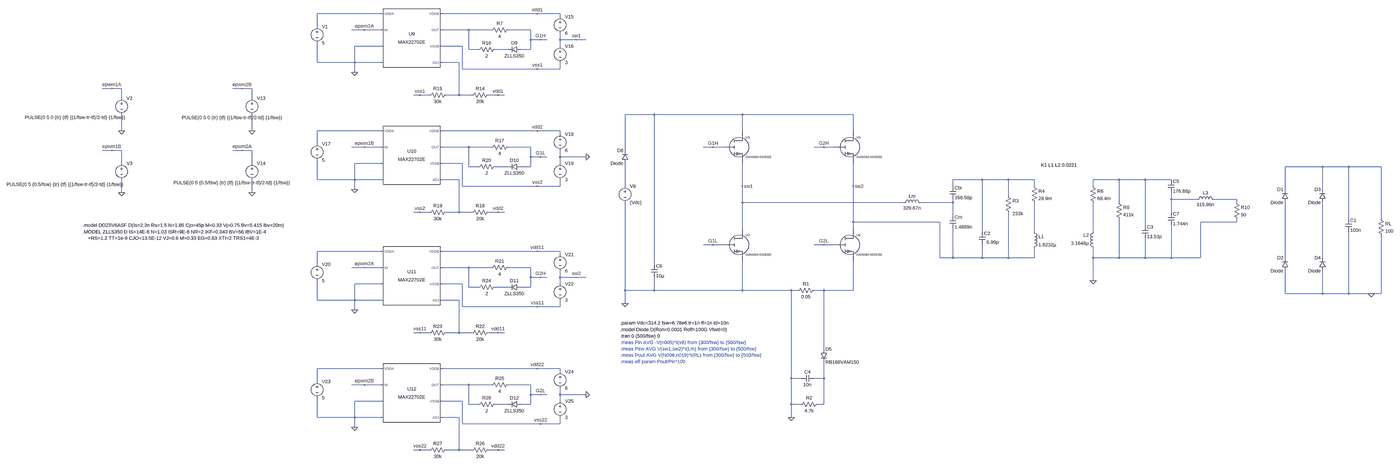
[diagram p0: schematic 1kW_LCCLS_sim.asc, whole sheet]
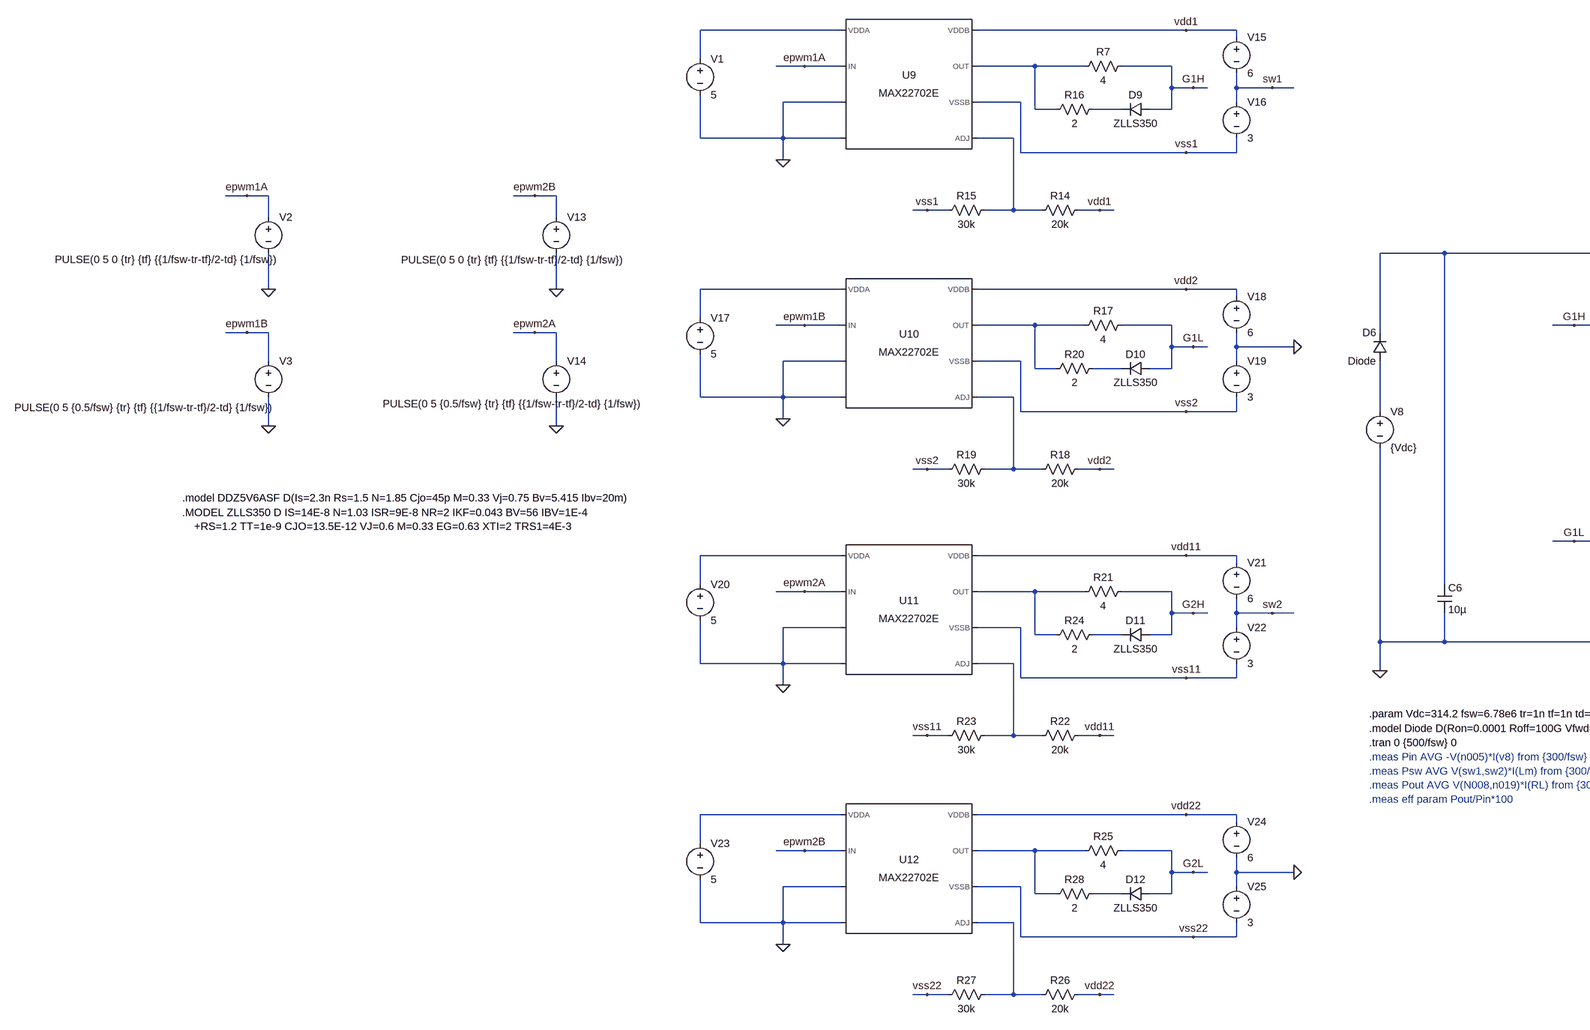
[diagram p1: schematic 1kW_LCCLS_sim.asc, part, row 1 of 1, column 1 of 2]
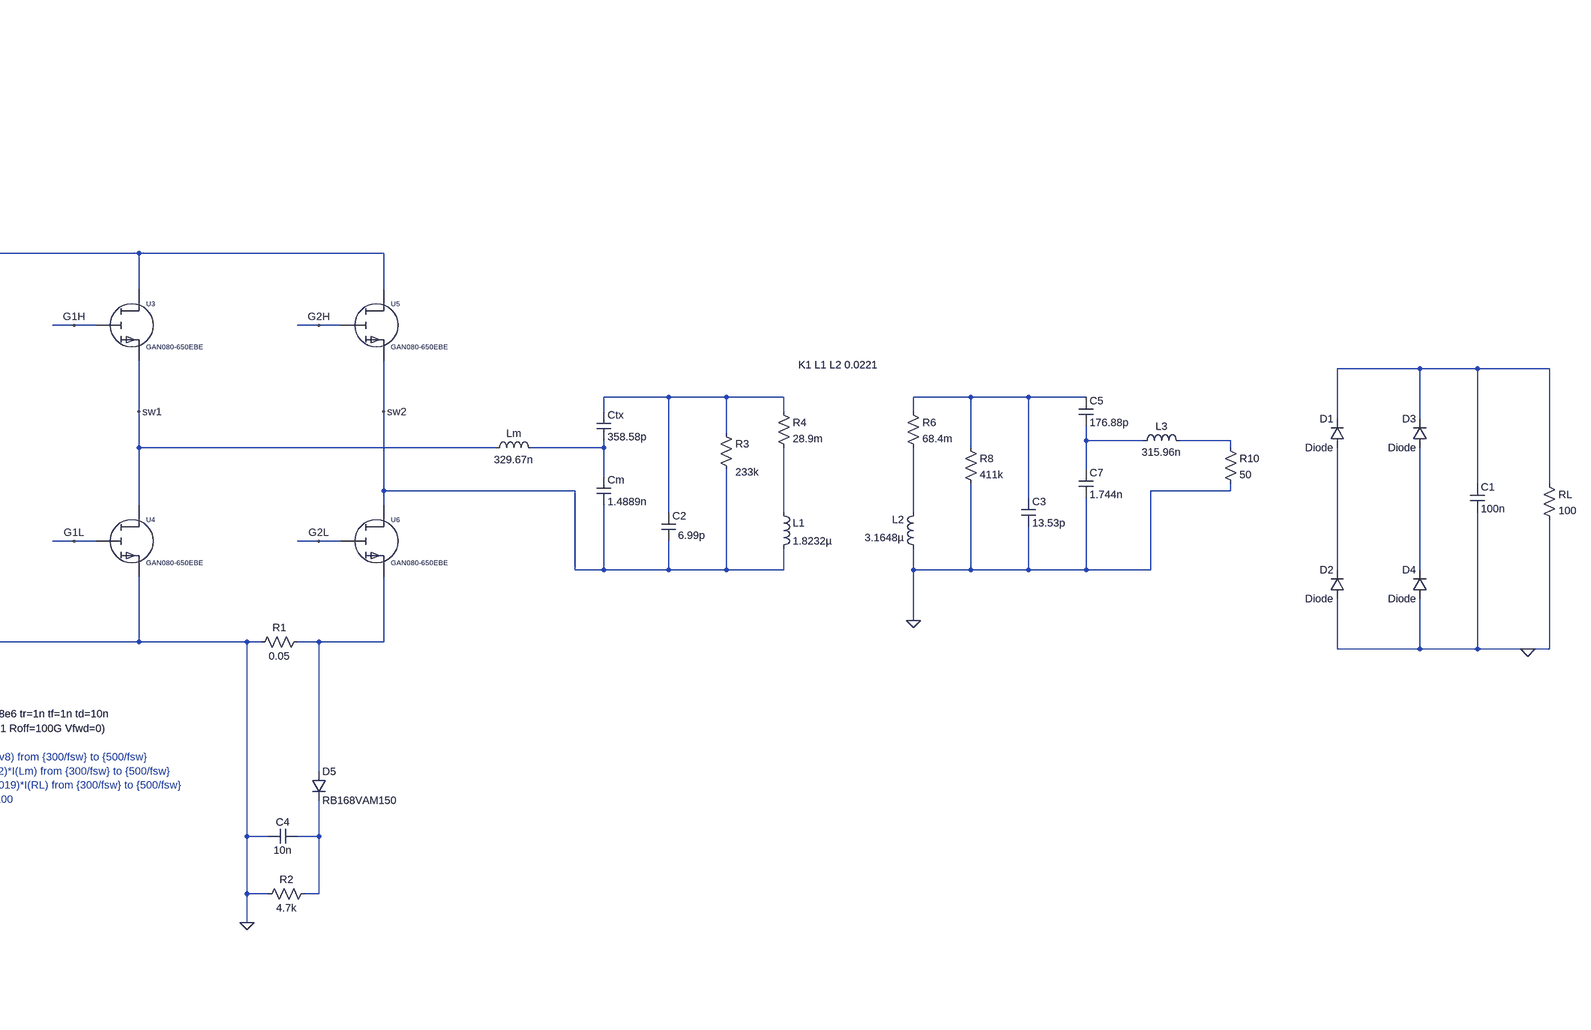
[diagram p2: schematic 1kW_LCCLS_sim.asc, part, row 1 of 1, column 2 of 2]
1kW_LCCLS_sim.asc, the LTspice schematic file:
Version 4.1
SHEET 1 3412 680
WIRE -2160 -4192 -2496 -4192
WIRE -1392 -4192 -1856 -4192
WIRE -1280 -4192 -1392 -4192
WIRE -1280 -4176 -1280 -4192
WIRE -2496 -4128 -2496 -4192
WIRE -2240 -4112 -2304 -4112
WIRE -2160 -4112 -2240 -4112
WIRE -1728 -4112 -1856 -4112
WIRE -1616 -4112 -1728 -4112
WIRE -1424 -4112 -1536 -4112
WIRE -1424 -4064 -1424 -4112
WIRE -1376 -4064 -1424 -4064
WIRE -1344 -4064 -1376 -4064
WIRE -1280 -4064 -1280 -4096
WIRE -1200 -4064 -1280 -4064
WIRE -1152 -4064 -1200 -4064
WIRE -2160 -4032 -2288 -4032
WIRE -1760 -4032 -1856 -4032
WIRE -1280 -4032 -1280 -4064
WIRE -1728 -4016 -1728 -4112
WIRE -1680 -4016 -1728 -4016
WIRE -1536 -4016 -1600 -4016
WIRE -1424 -4016 -1424 -4064
WIRE -1424 -4016 -1472 -4016
WIRE -2496 -3952 -2496 -4048
WIRE -2288 -3952 -2288 -4032
WIRE -2288 -3952 -2496 -3952
WIRE -2160 -3952 -2288 -3952
WIRE -1776 -3952 -1856 -3952
WIRE -1760 -3920 -1760 -4032
WIRE -1392 -3920 -1760 -3920
WIRE -1280 -3920 -1280 -3952
WIRE -1280 -3920 -1392 -3920
WIRE -2288 -3904 -2288 -3952
WIRE -3872 -3824 -3920 -3824
WIRE -3824 -3824 -3872 -3824
WIRE -3232 -3824 -3280 -3824
WIRE -3184 -3824 -3232 -3824
WIRE -1968 -3792 -2000 -3792
WIRE -1920 -3792 -1968 -3792
WIRE -1776 -3792 -1776 -3952
WIRE -1776 -3792 -1840 -3792
WIRE -1712 -3792 -1776 -3792
WIRE -1584 -3792 -1632 -3792
WIRE -1552 -3792 -1584 -3792
WIRE -3824 -3776 -3824 -3824
WIRE -3184 -3776 -3184 -3824
WIRE -592 -3696 -736 -3696
WIRE -160 -3696 -592 -3696
WIRE 384 -3696 -160 -3696
WIRE -3824 -3616 -3824 -3696
WIRE -3184 -3616 -3184 -3696
WIRE -2160 -3616 -2496 -3616
WIRE -1392 -3616 -1856 -3616
WIRE -1280 -3616 -1392 -3616
WIRE -160 -3616 -160 -3696
WIRE 384 -3616 384 -3696
WIRE -1280 -3600 -1280 -3616
WIRE -2496 -3552 -2496 -3616
WIRE -2240 -3536 -2304 -3536
WIRE -2160 -3536 -2240 -3536
WIRE -1728 -3536 -1856 -3536
WIRE -1616 -3536 -1728 -3536
WIRE -1424 -3536 -1536 -3536
WIRE -304 -3536 -352 -3536
WIRE -256 -3536 -304 -3536
WIRE 240 -3536 192 -3536
WIRE 288 -3536 240 -3536
WIRE -3872 -3520 -3920 -3520
WIRE -3824 -3520 -3872 -3520
WIRE -3232 -3520 -3280 -3520
WIRE -3184 -3520 -3232 -3520
WIRE -736 -3520 -736 -3696
WIRE -1424 -3488 -1424 -3536
WIRE -1376 -3488 -1424 -3488
WIRE -1344 -3488 -1376 -3488
WIRE -1280 -3488 -1280 -3520
WIRE -1152 -3488 -1280 -3488
WIRE -3824 -3456 -3824 -3520
WIRE -3184 -3456 -3184 -3520
WIRE -2160 -3456 -2288 -3456
WIRE -1760 -3456 -1856 -3456
WIRE -1280 -3456 -1280 -3488
WIRE -1728 -3440 -1728 -3536
WIRE -1680 -3440 -1728 -3440
WIRE -1536 -3440 -1600 -3440
WIRE -1424 -3440 -1424 -3488
WIRE -1424 -3440 -1472 -3440
WIRE 3056 -3440 2864 -3440
WIRE 3184 -3440 3056 -3440
WIRE 3344 -3440 3184 -3440
WIRE -2496 -3376 -2496 -3472
WIRE -2288 -3376 -2288 -3456
WIRE -2288 -3376 -2496 -3376
WIRE -2160 -3376 -2288 -3376
WIRE -1776 -3376 -1856 -3376
WIRE 1136 -3376 992 -3376
WIRE 1264 -3376 1136 -3376
WIRE 1392 -3376 1264 -3376
WIRE 1808 -3376 1680 -3376
WIRE 1936 -3376 1808 -3376
WIRE 2064 -3376 1936 -3376
WIRE -1760 -3344 -1760 -3456
WIRE -1392 -3344 -1760 -3344
WIRE -1280 -3344 -1280 -3376
WIRE -1280 -3344 -1392 -3344
WIRE -736 -3344 -736 -3456
WIRE -160 -3344 -160 -3456
WIRE 384 -3344 384 -3456
WIRE 992 -3344 992 -3376
WIRE 1392 -3344 1392 -3376
WIRE 1680 -3344 1680 -3376
WIRE -2288 -3328 -2288 -3376
WIRE 2864 -3328 2864 -3440
WIRE 3056 -3328 3056 -3440
WIRE -3824 -3312 -3824 -3376
WIRE -3184 -3312 -3184 -3376
WIRE 1264 -3296 1264 -3376
WIRE 2064 -3280 2064 -3312
WIRE 2192 -3280 2064 -3280
WIRE 2432 -3280 2272 -3280
WIRE -160 -3264 -160 -3344
WIRE 752 -3264 -160 -3264
WIRE 992 -3264 992 -3280
WIRE 992 -3264 832 -3264
WIRE 1808 -3264 1808 -3376
WIRE 2432 -3264 2432 -3280
WIRE -1968 -3216 -2000 -3216
WIRE -1920 -3216 -1968 -3216
WIRE -1776 -3216 -1776 -3376
WIRE -1776 -3216 -1840 -3216
WIRE -1712 -3216 -1776 -3216
WIRE -1584 -3216 -1632 -3216
WIRE -1552 -3216 -1584 -3216
WIRE 2064 -3216 2064 -3280
WIRE 992 -3200 992 -3264
WIRE 3184 -3184 3184 -3440
WIRE 3344 -3184 3344 -3440
WIRE 384 -3168 384 -3344
WIRE 928 -3168 384 -3168
WIRE 2432 -3168 2432 -3184
WIRE 2432 -3168 2208 -3168
WIRE 1936 -3152 1936 -3376
WIRE -160 -3136 -160 -3264
WIRE 384 -3136 384 -3168
WIRE 1136 -3120 1136 -3376
WIRE 1392 -3120 1392 -3264
WIRE 1680 -3120 1680 -3264
WIRE -304 -3056 -352 -3056
WIRE -256 -3056 -304 -3056
WIRE 240 -3056 192 -3056
WIRE 288 -3056 240 -3056
WIRE -2160 -3024 -2496 -3024
WIRE -1392 -3024 -1856 -3024
WIRE -1280 -3024 -1392 -3024
WIRE -1280 -3008 -1280 -3024
WIRE 928 -2992 928 -3168
WIRE 992 -2992 992 -3136
WIRE 992 -2992 928 -2992
WIRE 1136 -2992 1136 -3056
WIRE 1136 -2992 992 -2992
WIRE 1264 -2992 1264 -3216
WIRE 1264 -2992 1136 -2992
WIRE 1392 -2992 1392 -3040
WIRE 1392 -2992 1264 -2992
WIRE 1680 -2992 1680 -3040
WIRE 1808 -2992 1808 -3184
WIRE 1808 -2992 1680 -2992
WIRE 1936 -2992 1936 -3088
WIRE 1936 -2992 1808 -2992
WIRE 2064 -2992 2064 -3152
WIRE 2064 -2992 1936 -2992
WIRE 2208 -2992 2208 -3168
WIRE 2208 -2992 2064 -2992
WIRE 2864 -2992 2864 -3264
WIRE 3056 -2992 3056 -3264
WIRE -2496 -2960 -2496 -3024
WIRE -592 -2960 -592 -3696
WIRE -2240 -2944 -2304 -2944
WIRE -2160 -2944 -2240 -2944
WIRE -1728 -2944 -1856 -2944
WIRE -1616 -2944 -1728 -2944
WIRE -1424 -2944 -1536 -2944
WIRE -1424 -2896 -1424 -2944
WIRE -1376 -2896 -1424 -2896
WIRE -1344 -2896 -1376 -2896
WIRE -1280 -2896 -1280 -2928
WIRE -1200 -2896 -1280 -2896
WIRE -1152 -2896 -1200 -2896
WIRE 1680 -2880 1680 -2992
WIRE -2160 -2864 -2288 -2864
WIRE -1760 -2864 -1856 -2864
WIRE -1280 -2864 -1280 -2896
WIRE -1728 -2848 -1728 -2944
WIRE -1680 -2848 -1728 -2848
WIRE -1536 -2848 -1600 -2848
WIRE -1424 -2848 -1424 -2896
WIRE -1424 -2848 -1472 -2848
WIRE -736 -2832 -736 -3264
WIRE -592 -2832 -592 -2896
WIRE -592 -2832 -736 -2832
WIRE -160 -2832 -160 -2976
WIRE -160 -2832 -592 -2832
WIRE 80 -2832 -160 -2832
WIRE 112 -2832 80 -2832
WIRE 240 -2832 192 -2832
WIRE 384 -2832 384 -2976
WIRE 384 -2832 240 -2832
WIRE 2864 -2816 2864 -2928
WIRE 3056 -2816 3056 -2928
WIRE 3056 -2816 2864 -2816
WIRE 3184 -2816 3184 -3120
WIRE 3184 -2816 3056 -2816
WIRE 3296 -2816 3184 -2816
WIRE 3344 -2816 3344 -3104
WIRE 3344 -2816 3296 -2816
WIRE -2496 -2784 -2496 -2880
WIRE -2288 -2784 -2288 -2864
WIRE -2288 -2784 -2496 -2784
WIRE -2160 -2784 -2288 -2784
WIRE -1776 -2784 -1856 -2784
WIRE -736 -2768 -736 -2832
WIRE -1760 -2752 -1760 -2864
WIRE -1392 -2752 -1760 -2752
WIRE -1280 -2752 -1280 -2784
WIRE -1280 -2752 -1392 -2752
WIRE -2288 -2736 -2288 -2784
WIRE -1968 -2624 -2000 -2624
WIRE -1920 -2624 -1968 -2624
WIRE -1776 -2624 -1776 -2784
WIRE -1776 -2624 -1840 -2624
WIRE -1712 -2624 -1776 -2624
WIRE -1584 -2624 -1632 -2624
WIRE -1552 -2624 -1584 -2624
WIRE 240 -2544 240 -2832
WIRE -2160 -2448 -2496 -2448
WIRE -1392 -2448 -1856 -2448
WIRE -1280 -2448 -1392 -2448
WIRE -1280 -2432 -1280 -2448
WIRE 80 -2400 80 -2832
WIRE 128 -2400 80 -2400
WIRE 240 -2400 240 -2480
WIRE 240 -2400 192 -2400
WIRE -2496 -2384 -2496 -2448
WIRE -2240 -2368 -2304 -2368
WIRE -2160 -2368 -2240 -2368
WIRE -1728 -2368 -1856 -2368
WIRE -1616 -2368 -1728 -2368
WIRE -1424 -2368 -1536 -2368
WIRE -1424 -2320 -1424 -2368
WIRE -1376 -2320 -1424 -2320
WIRE -1344 -2320 -1376 -2320
WIRE -1280 -2320 -1280 -2352
WIRE -1152 -2320 -1280 -2320
WIRE -2160 -2288 -2288 -2288
WIRE -1760 -2288 -1856 -2288
WIRE -1280 -2288 -1280 -2320
WIRE -1728 -2272 -1728 -2368
WIRE -1680 -2272 -1728 -2272
WIRE -1536 -2272 -1600 -2272
WIRE -1424 -2272 -1424 -2320
WIRE -1424 -2272 -1472 -2272
WIRE 80 -2272 80 -2400
WIRE 128 -2272 80 -2272
WIRE 240 -2272 240 -2400
WIRE 240 -2272 208 -2272
WIRE -2496 -2208 -2496 -2304
WIRE -2288 -2208 -2288 -2288
WIRE -2288 -2208 -2496 -2208
WIRE -2160 -2208 -2288 -2208
WIRE -1776 -2208 -1856 -2208
WIRE 80 -2208 80 -2272
WIRE -1760 -2176 -1760 -2288
WIRE -1376 -2176 -1760 -2176
WIRE -1280 -2176 -1280 -2208
WIRE -1280 -2176 -1376 -2176
WIRE -2288 -2160 -2288 -2208
WIRE -1968 -2048 -2000 -2048
WIRE -1920 -2048 -1968 -2048
WIRE -1776 -2048 -1776 -2208
WIRE -1776 -2048 -1840 -2048
WIRE -1712 -2048 -1776 -2048
WIRE -1584 -2048 -1632 -2048
WIRE -1552 -2048 -1584 -2048
FLAG -3872 -3824 epwm1A
FLAG -3872 -3520 epwm1B
FLAG -3824 -3616 0
FLAG -3824 -3312 0
FLAG -160 -3344 sw1
FLAG -736 -2768 0
FLAG -304 -3536 G1H
FLAG -304 -3056 G1L
FLAG 384 -3344 sw2
FLAG 240 -3536 G2H
FLAG 240 -3056 G2L
FLAG -3232 -3520 epwm2A
FLAG -3232 -3824 epwm2B
FLAG -3184 -3616 0
FLAG -3184 -3312 0
FLAG -1376 -4064 G1H
FLAG -2240 -4112 epwm1A
FLAG -2288 -3904 0
FLAG -1968 -3792 vss1
FLAG -1584 -3792 vdd1
FLAG -1392 -4192 vdd1
FLAG -1200 -4064 sw1
FLAG -1376 -3488 G1L
FLAG -2240 -3536 epwm1B
FLAG -2288 -3328 0
FLAG -1584 -3216 vdd2
FLAG -1392 -3616 vdd2
FLAG -1152 -3488 0
FLAG -1376 -2896 G2H
FLAG -2240 -2944 epwm2A
FLAG -2288 -2736 0
FLAG -1968 -2624 vss11
FLAG -1584 -2624 vdd11
FLAG -1392 -3024 vdd11
FLAG -1200 -2896 sw2
FLAG -1376 -2320 G2L
FLAG -2240 -2368 epwm2B
FLAG -2288 -2160 0
FLAG -1584 -2048 vdd22
FLAG -1392 -2448 vdd22
FLAG -1152 -2320 0
FLAG -1968 -2048 vss22
FLAG -1392 -3920 vss1
FLAG -1392 -3344 vss2
FLAG -1392 -2752 vss11
FLAG -1376 -2176 vss22
FLAG -1968 -3216 vss2
FLAG 80 -2208 0
FLAG 3296 -2816 0
FLAG 1680 -2880 0
SYMBOL ind 736 -3248 R270
WINDOW 0 32 56 VTop 2
WINDOW 3 5 56 VBottom 2
SYMATTR InstName Lm
SYMATTR Value 329.67n
SYMATTR SpiceLine Rser=1m
SYMBOL cap 976 -3200 R0
SYMATTR InstName Cm
SYMATTR Value 1.4889n
SYMBOL cap 976 -3344 R0
SYMATTR InstName Ctx
SYMATTR Value 358.58p
SYMBOL res 3328 -3200 R0
SYMATTR InstName RL
SYMATTR Value 100
SYMBOL voltage -3824 -3792 R0
WINDOW 123 0 0 Left 0
WINDOW 39 -273 152 Left 2
WINDOW 3 -475 110 Left 2
SYMATTR Value PULSE(0 5 0 {tr} {tf} {{1/fsw-tr-tf}/2-td} {1/fsw})
SYMATTR InstName V2
SYMBOL voltage -3824 -3472 R0
WINDOW 123 0 0 Left 0
WINDOW 39 -302 150 Left 2
WINDOW 3 -565 119 Left 2
SYMATTR Value PULSE(0 5 {0.5/fsw} {tr} {tf} {{1/fsw-tr-tf}/2-td} {1/fsw})
SYMATTR InstName V3
SYMBOL model\\GAN080-650EBE -176 -3536 R0
SYMATTR InstName U3
SYMBOL model\\GAN080-650EBE -176 -3056 R0
SYMATTR InstName U4
SYMBOL voltage -736 -3360 R0
WINDOW 123 0 0 Left 0
WINDOW 39 0 0 Left 0
SYMATTR InstName V8
SYMATTR Value {Vdc}
SYMBOL model\\GAN080-650EBE 368 -3536 R0
SYMATTR InstName U5
SYMBOL model\\GAN080-650EBE 368 -3056 R0
SYMATTR InstName U6
SYMBOL voltage -3184 -3792 R0
WINDOW 123 0 0 Left 0
WINDOW 39 -273 152 Left 2
WINDOW 3 -345 111 Left 2
SYMATTR Value PULSE(0 5 0 {tr} {tf} {{1/fsw-tr-tf}/2-td} {1/fsw})
SYMATTR InstName V13
SYMBOL voltage -3184 -3472 R0
WINDOW 123 0 0 Left 0
WINDOW 39 -302 150 Left 2
WINDOW 3 -386 111 Left 2
SYMATTR Value PULSE(0 5 {0.5/fsw} {tr} {tf} {{1/fsw-tr-tf}/2-td} {1/fsw})
SYMATTR InstName V14
SYMBOL PowerProducts\\MAX22702E -2016 -4112 R0
SYMATTR InstName U9
SYMBOL diode -1472 -4032 R90
WINDOW 0 0 32 VBottom 2
WINDOW 3 32 32 VTop 2
SYMATTR InstName D9
SYMATTR Value ZLLS350
SYMBOL res -1520 -4128 R90
WINDOW 0 0 56 VBottom 2
WINDOW 3 32 56 VTop 2
SYMATTR InstName R7
SYMATTR Value 4
SYMBOL voltage -2496 -4144 R0
WINDOW 123 0 0 Left 0
WINDOW 39 0 0 Left 0
SYMATTR InstName V1
SYMATTR Value 5
SYMBOL res -1616 -3808 R90
WINDOW 0 0 56 VBottom 2
WINDOW 3 32 56 VTop 2
SYMATTR InstName R14
SYMATTR Value 20k
SYMBOL res -1824 -3808 R90
WINDOW 0 0 56 VBottom 2
WINDOW 3 32 56 VTop 2
SYMATTR InstName R15
SYMATTR Value 30k
SYMBOL voltage -1280 -4192 R0
WINDOW 123 0 0 Left 0
WINDOW 39 0 0 Left 0
SYMATTR InstName V15
SYMATTR Value 6
SYMBOL res -1584 -4032 R90
WINDOW 0 0 56 VBottom 2
WINDOW 3 32 56 VTop 2
SYMATTR InstName R16
SYMATTR Value 2
SYMBOL voltage -1280 -4048 R0
WINDOW 123 0 0 Left 0
WINDOW 39 0 0 Left 0
SYMATTR InstName V16
SYMATTR Value 3
SYMBOL PowerProducts\\MAX22702E -2016 -3536 R0
SYMATTR InstName U10
SYMBOL diode -1472 -3456 R90
WINDOW 0 0 32 VBottom 2
WINDOW 3 32 32 VTop 2
SYMATTR InstName D10
SYMATTR Value ZLLS350
SYMBOL res -1520 -3552 R90
WINDOW 0 0 56 VBottom 2
WINDOW 3 32 56 VTop 2
SYMATTR InstName R17
SYMATTR Value 4
SYMBOL voltage -2496 -3568 R0
WINDOW 123 0 0 Left 0
WINDOW 39 0 0 Left 0
SYMATTR InstName V17
SYMATTR Value 5
SYMBOL res -1616 -3232 R90
WINDOW 0 0 56 VBottom 2
WINDOW 3 32 56 VTop 2
SYMATTR InstName R18
SYMATTR Value 20k
SYMBOL res -1824 -3232 R90
WINDOW 0 0 56 VBottom 2
WINDOW 3 32 56 VTop 2
SYMATTR InstName R19
SYMATTR Value 30k
SYMBOL voltage -1280 -3616 R0
WINDOW 123 0 0 Left 0
WINDOW 39 0 0 Left 0
SYMATTR InstName V18
SYMATTR Value 6
SYMBOL res -1584 -3456 R90
WINDOW 0 0 56 VBottom 2
WINDOW 3 32 56 VTop 2
SYMATTR InstName R20
SYMATTR Value 2
SYMBOL voltage -1280 -3472 R0
WINDOW 123 0 0 Left 0
WINDOW 39 0 0 Left 0
SYMATTR InstName V19
SYMATTR Value 3
SYMBOL PowerProducts\\MAX22702E -2016 -2944 R0
SYMATTR InstName U11
SYMBOL diode -1472 -2864 R90
WINDOW 0 0 32 VBottom 2
WINDOW 3 32 32 VTop 2
SYMATTR InstName D11
SYMATTR Value ZLLS350
SYMBOL res -1520 -2960 R90
WINDOW 0 0 56 VBottom 2
WINDOW 3 32 56 VTop 2
SYMATTR InstName R21
SYMATTR Value 4
SYMBOL voltage -2496 -2976 R0
WINDOW 123 0 0 Left 0
WINDOW 39 0 0 Left 0
SYMATTR InstName V20
SYMATTR Value 5
SYMBOL res -1616 -2640 R90
WINDOW 0 0 56 VBottom 2
WINDOW 3 32 56 VTop 2
SYMATTR InstName R22
SYMATTR Value 20k
SYMBOL res -1824 -2640 R90
WINDOW 0 0 56 VBottom 2
WINDOW 3 32 56 VTop 2
SYMATTR InstName R23
SYMATTR Value 30k
SYMBOL voltage -1280 -3024 R0
WINDOW 123 0 0 Left 0
WINDOW 39 0 0 Left 0
SYMATTR InstName V21
SYMATTR Value 6
SYMBOL res -1584 -2864 R90
WINDOW 0 0 56 VBottom 2
WINDOW 3 32 56 VTop 2
SYMATTR InstName R24
SYMATTR Value 2
SYMBOL voltage -1280 -2880 R0
WINDOW 123 0 0 Left 0
WINDOW 39 0 0 Left 0
SYMATTR InstName V22
SYMATTR Value 3
SYMBOL PowerProducts\\MAX22702E -2016 -2368 R0
SYMATTR InstName U12
SYMBOL diode -1472 -2288 R90
WINDOW 0 0 32 VBottom 2
WINDOW 3 32 32 VTop 2
SYMATTR InstName D12
SYMATTR Value ZLLS350
SYMBOL res -1520 -2384 R90
WINDOW 0 0 56 VBottom 2
WINDOW 3 32 56 VTop 2
SYMATTR InstName R25
SYMATTR Value 4
SYMBOL voltage -2496 -2400 R0
WINDOW 123 0 0 Left 0
WINDOW 39 0 0 Left 0
SYMATTR InstName V23
SYMATTR Value 5
SYMBOL res -1616 -2064 R90
WINDOW 0 0 56 VBottom 2
WINDOW 3 32 56 VTop 2
SYMATTR InstName R26
SYMATTR Value 20k
SYMBOL res -1824 -2064 R90
WINDOW 0 0 56 VBottom 2
WINDOW 3 32 56 VTop 2
SYMATTR InstName R27
SYMATTR Value 30k
SYMBOL voltage -1280 -2448 R0
WINDOW 123 0 0 Left 0
WINDOW 39 0 0 Left 0
SYMATTR InstName V24
SYMATTR Value 6
SYMBOL res -1584 -2288 R90
WINDOW 0 0 56 VBottom 2
WINDOW 3 32 56 VTop 2
SYMATTR InstName R28
SYMATTR Value 2
SYMBOL voltage -1280 -2304 R0
WINDOW 123 0 0 Left 0
WINDOW 39 0 0 Left 0
SYMATTR InstName V25
SYMATTR Value 3
SYMBOL diode 2880 -3264 R180
WINDOW 0 24 64 Left 2
WINDOW 3 24 0 Left 2
SYMATTR InstName D1
SYMATTR Value Diode
SYMBOL diode 2880 -2928 R180
WINDOW 0 24 64 Left 2
WINDOW 3 24 0 Left 2
SYMATTR InstName D2
SYMATTR Value Diode
SYMBOL diode 3072 -3264 R180
WINDOW 0 24 64 Left 2
WINDOW 3 24 0 Left 2
SYMATTR InstName D3
SYMATTR Value Diode
SYMBOL diode 3072 -2928 R180
WINDOW 0 24 64 Left 2
WINDOW 3 24 0 Left 2
SYMATTR InstName D4
SYMATTR Value Diode
SYMBOL cap 3168 -3184 R0
SYMATTR InstName C1
SYMATTR Value 100n
SYMBOL cap 192 -2416 R90
WINDOW 0 0 32 VBottom 2
WINDOW 3 32 32 VTop 2
SYMATTR InstName C4
SYMATTR Value 10n
SYMBOL res 224 -2288 R90
WINDOW 0 0 56 VBottom 2
WINDOW 3 32 56 VTop 2
SYMATTR InstName R2
SYMATTR Value 4.7k
SYMBOL diode 224 -2544 R0
SYMATTR InstName D5
SYMATTR Value RB168VAM150
SYMBOL res 208 -2848 R90
WINDOW 0 0 56 VBottom 2
WINDOW 3 32 56 VTop 2
SYMATTR InstName R1
SYMATTR Value 0.05
SYMBOL res 1376 -3360 R0
SYMATTR InstName R4
SYMATTR Value 28.9m
SYMBOL ind 1376 -3136 R0
SYMATTR InstName L1
SYMATTR Value 1.8232µ
SYMATTR Type ind
SYMATTR SpiceLine Rser=1m
SYMBOL ind 1696 -3024 R180
WINDOW 0 36 80 Left 2
WINDOW 3 36 40 Left 2
SYMATTR InstName L2
SYMATTR Value 3.1648µ
SYMATTR Type ind
SYMATTR SpiceLine Rser=1m
SYMBOL res 1664 -3360 R0
SYMATTR InstName R6
SYMATTR Value 68.4m
SYMBOL cap 2048 -3376 R0
SYMATTR InstName C5
SYMATTR Value 176.88p
SYMBOL diode -720 -3456 R180
WINDOW 0 24 64 Left 2
WINDOW 3 24 0 Left 2
SYMATTR InstName D6
SYMATTR Value Diode
SYMBOL cap -608 -2960 R0
SYMATTR InstName C6
SYMATTR Value 10µ
SYMATTR SpiceLine Rser=10m
SYMBOL cap 1120 -3120 R0
WINDOW 3 37 51 Left 2
SYMATTR Value 6.99p
SYMATTR InstName C2
SYMBOL res 1248 -3312 R0
WINDOW 3 36 102 Left 2
SYMATTR Value 233k
SYMATTR InstName R3
SYMBOL res 1792 -3280 R0
SYMATTR InstName R8
SYMATTR Value 411k
SYMBOL cap 1920 -3152 R0
SYMATTR InstName C3
SYMATTR Value 13.53p
SYMBOL cap 2048 -3216 R0
SYMATTR InstName C7
SYMATTR Value 1.744n
SYMBOL ind 2176 -3264 R270
WINDOW 0 32 56 VTop 2
WINDOW 3 5 56 VBottom 2
SYMATTR InstName L3
SYMATTR Value 315.96n
SYMATTR SpiceLine Rser=1m
SYMBOL res 2416 -3280 R0
SYMATTR InstName R10
SYMATTR Value 50
TEXT -4016 -3120 Left 2 !.MODEL ZLLS350 D IS=14E-8 N=1.03 ISR=9E-8 NR=2 IKF=0.043 BV=56 IBV=1E-4\n    +RS=1.2 TT=1e-9 CJO=13.5E-12 VJ=0.6 M=0.33 EG=0.63 XTI=2 TRS1=4E-3
TEXT -4016 -3152 Left 2 !.model DDZ5V6ASF D(Is=2.3n Rs=1.5 N=1.85 Cjo=45p M=0.33 Vj=0.75 Bv=5.415 Ibv=20m)
TEXT -760 -2672 Left 2 !.param Vdc=314.2 fsw=6.78e6 tr=1n tf=1n td=10n
TEXT -760 -2608 Left 2 !.tran 0 {500/fsw} 0
TEXT -760 -2576 Left 2 ;.meas Pin AVG -V(n005)*I(v8) from {300/fsw} to {500/fsw}\n.meas Psw AVG V(sw1,sw2)*I(Lm) from {300/fsw} to {500/fsw}\n.meas Pout AVG V(N008,n019)*I(RL) from {300/fsw} to {500/fsw}\n.meas eff param Pout/Pin*100
TEXT -760 -2640 Left 2 !.model Diode D(Ron=0.0001 Roff=100G Vfwd=0)
TEXT 1424 -3448 Left 2 !K1 L1 L2 0.0221

The netlist it stands for:
* 1kW_LCCLS_sim.asc
Lm sw1 N016 329.67n Rser=1m
Cm N016 sw2 1.4889n
Ctx N011 N016 358.58p
RL N009 0 100
V2 epwm1A 0 PULSE(0 5 0 {tr} {tf} {{1/fsw-tr-tf}/2-td} {1/fsw})
V3 epwm1B 0 PULSE(0 5 {0.5/fsw} {tr} {tf} {{1/fsw-tr-tf}/2-td} {1/fsw})
X§U3 N005 G1H sw1 GAN080-650EBE  ; pins Drain Gate Source
X§U4 sw1 G1L 0 GAN080-650EBE  ; pins Drain Gate Source
V8 N013 0 {Vdc}
X§U5 N005 G2H sw2 GAN080-650EBE  ; pins Drain Gate Source
X§U6 sw2 G2L N024 GAN080-650EBE  ; pins Drain Gate Source
V13 epwm2B 0 PULSE(0 5 0 {tr} {tf} {{1/fsw-tr-tf}/2-td} {1/fsw})
V14 epwm2A 0 PULSE(0 5 {0.5/fsw} {tr} {tf} {{1/fsw-tr-tf}/2-td} {1/fsw})
X§U9 N001 epwm1A 0 0 vdd1 N002 N004 vss1 MAX22702E  ; pins VDDA IN ? ? VDDB OUT ADJ VSSB
D9 G1H N003 ZLLS350
R7 G1H N002 4
V1 N001 0 5
R14 vdd1 N004 20k
R15 N004 vss1 30k
V15 vdd1 sw1 6
R16 N003 N002 2
V16 sw1 vss1 3
X§U10 N006 epwm1B 0 0 vdd2 N007 N010 vss2 MAX22702E  ; pins VDDA IN ? ? VDDB OUT ADJ VSSB
D10 G1L N008 ZLLS350
R17 G1L N007 4
V17 N006 0 5
R18 vdd2 N010 20k
R19 N010 vss2 30k
V18 vdd2 0 6
R20 N008 N007 2
V19 0 vss2 3
X§U11 N019 epwm2A 0 0 vdd11 N022 N025 vss11 MAX22702E  ; pins VDDA IN ? ? VDDB OUT ADJ VSSB
D11 G2H N023 ZLLS350
R21 G2H N022 4
V20 N019 0 5
R22 vdd11 N025 20k
R23 N025 vss11 30k
V21 vdd11 sw2 6
R24 N023 N022 2
V22 sw2 vss11 3
X§U12 N026 epwm2B 0 0 vdd22 N028 N030 vss22 MAX22702E  ; pins VDDA IN ? ? VDDB OUT ADJ VSSB
D12 G2L N029 ZLLS350
R25 G2L N028 4
V23 N026 0 5
R26 vdd22 N030 20k
R27 N030 vss22 30k
V24 vdd22 0 6
R28 N029 N028 2
V25 0 vss22 3
D1 N020 N009 Diode
D2 0 N020 Diode
D3 N021 N009 Diode
D4 0 N021 Diode
C1 N009 0 100n
C4 N027 0 10n
R2 N027 0 4.7k
D5 N024 N027 RB168VAM150
R1 N024 0 0.05
R4 N011 N017 28.9m
L1 N017 sw2 1.8232µ Rser=1m
L2 0 N018 3.1648µ Rser=1m
R6 N012 N018 68.4m
C5 N012 N014 176.88p
D6 N013 N005 Diode
C6 N005 0 10µ Rser=10m
C2 N011 sw2 6.99p
R3 N011 sw2 233k
R8 N012 0 411k
C3 N012 0 13.53p
C7 N014 0 1.744n
L3 N014 N015 315.96n Rser=1m
R10 N015 0 50
.model D D
.lib standard.dio
.MODEL ZLLS350 D IS=14E-8 N=1.03 ISR=9E-8 NR=2 IKF=0.043 BV=56 IBV=1E-4
    +RS=1.2 TT=1e-9 CJO=13.5E-12 VJ=0.6 M=0.33 EG=0.63 XTI=2 TRS1=4E-3
.model DDZ5V6ASF D(Is=2.3n Rs=1.5 N=1.85 Cjo=45p M=0.33 Vj=0.75 Bv=5.415 Ibv=20m)
.param Vdc=314.2 fsw=6.78e6 tr=1n tf=1n td=10n
.tran 0 {500/fsw} 0
* .meas Pin AVG -V(n005)*I(v8) from {300/fsw} to {500/fsw}
* .meas Psw AVG V(sw1,sw2)*I(Lm) from {300/fsw} to {500/fsw}
* .meas Pout AVG V(N008,n019)*I(RL) from {300/fsw} to {500/fsw}
* .meas eff param Pout/Pin*100
.model Diode D(Ron=0.0001 Roff=100G Vfwd=0)
K1 L1 L2 0.0221
.lib GAN080-650EBE_LTspice.lib
.lib MAX22702E.sub
.backanno
.end